# EasyEDA Pro project PCB.eprj

# Board PCB01
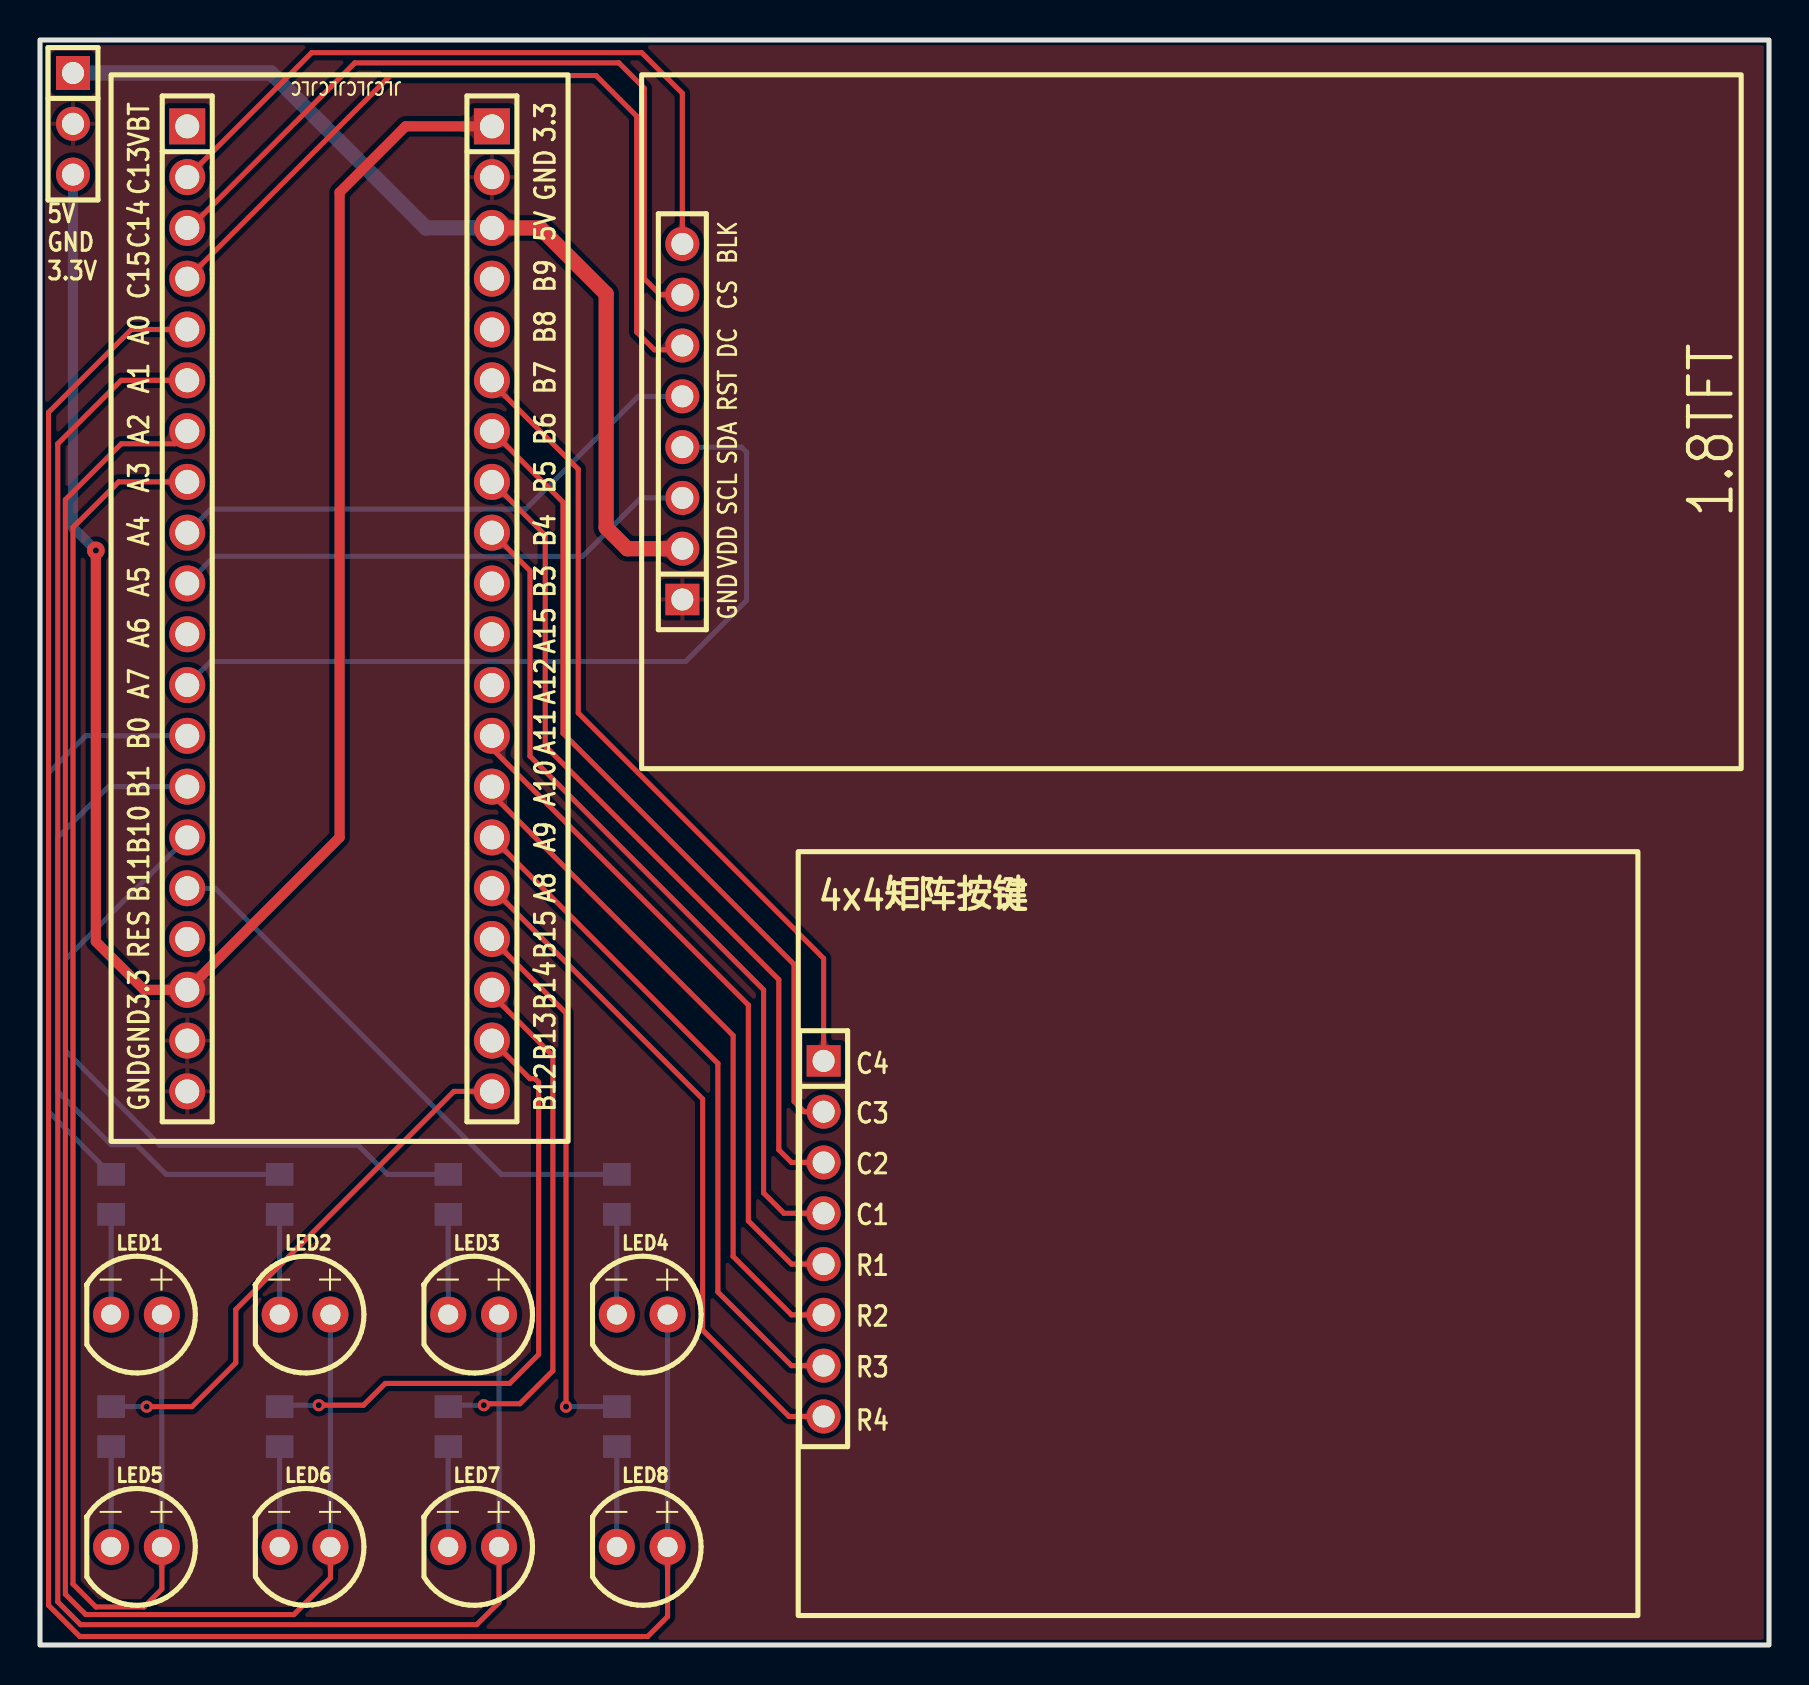
[diagram p0: board, top side]
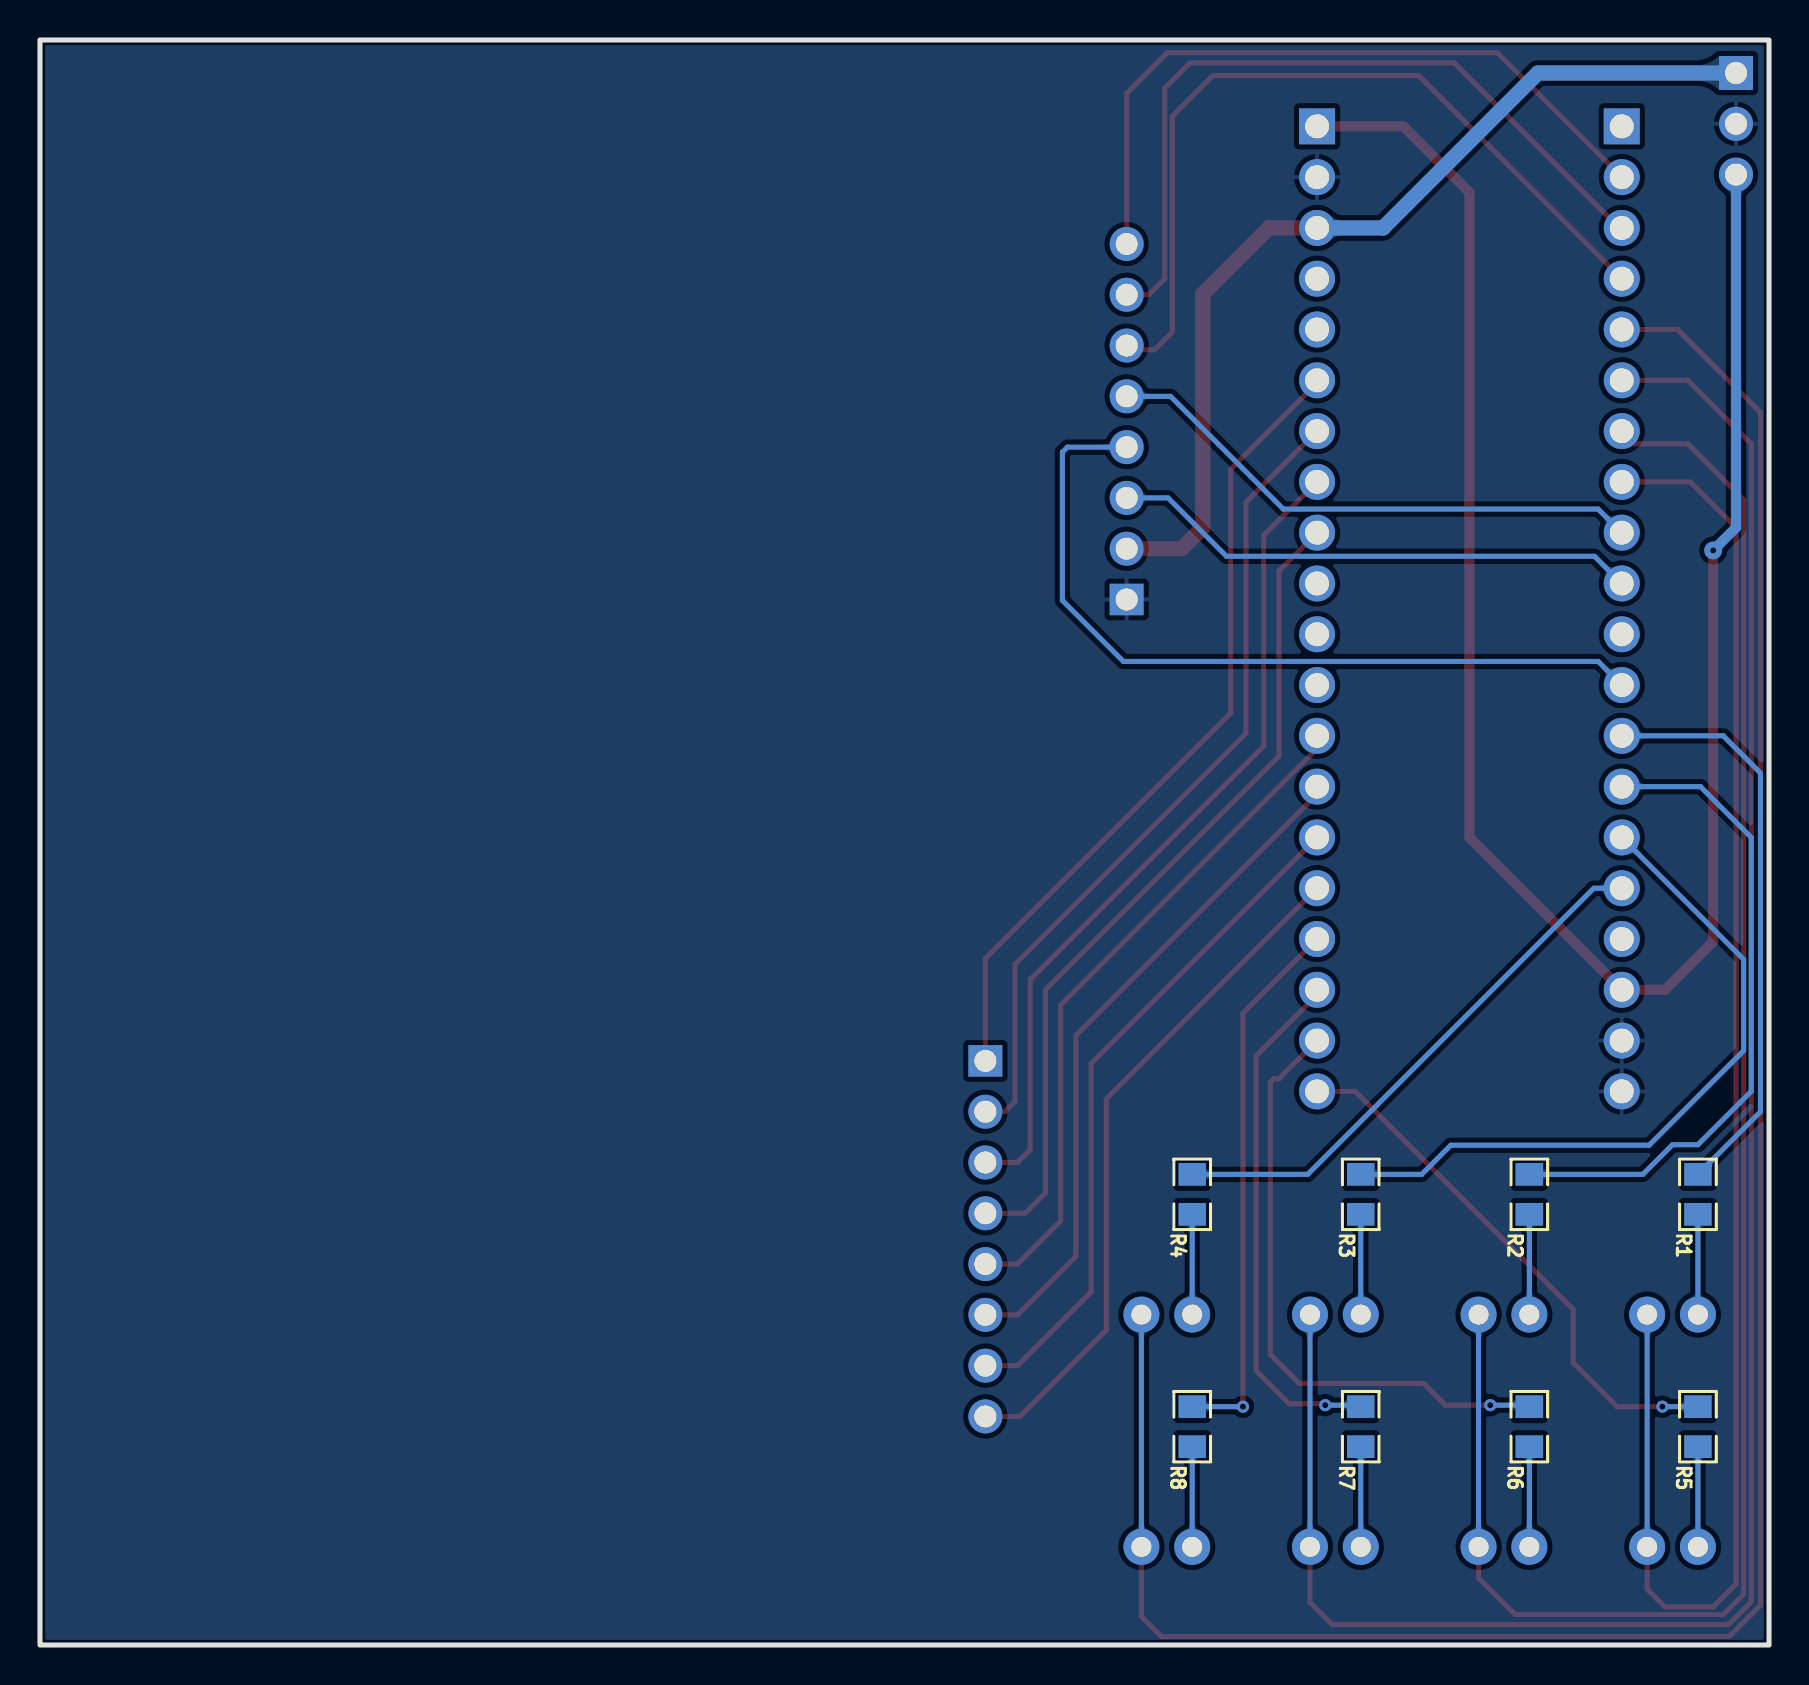
[diagram p1: board, bottom side, seen from below]

Outline 86.49 x 80.26 mm; copper layers: Top Layer, Bottom Layer. Coordinates in mm from the lower left corner of the outline.
Outline path: rectangle 0,80.26 86.49,0
Stack: Top Layer 0.035mm / Dielectric1 1.51mm FR4 er 4.5 / Bottom Layer 0.035mm

## Design rules (mm)
template: JLCPCB Capability(Two Layers Board)
spacing copperThickness1oz (default): track to track 0.102, other pairs 0.152 to 0.3
spacing copperThickness2oz: track to track 0.203, other pairs 0.152 to 0.3
track width copperThickness1oz (default): min 0.127, default 0.254, max 2.54
track width copperThickness2oz: min 0.203, default 0.254, max 2.54
differential pair differentialPair (default): width min 0.127, default 0.254, max 2.54; gap min 0.152, default 0.152
via viaSize (default): diameter min 0.5, default 0.61, max 10; hole min 0.3, default 0.305, max 6.3

## Placement (name value [footprint] x y rotation side)
H2  PZ254V-11-03P  [HDR-TH_3P-P2.54-V-M]  1.65 76.07 270 top
LED1  XL-502SURD  [LED-TH_BD5.9-P2.54-RD_RED]  4.83 16.52 0 top
LED2  XL-502SURD  [LED-TH_BD5.9-P2.54-RD_RED]  13.26 16.52 0 top
LED3  XL-502SURD  [LED-TH_BD5.9-P2.54-RD_RED]  21.69 16.52 0 top
LED4  XL-502SURD  [LED-TH_BD5.9-P2.54-RD_RED]  30.12 16.52 0 top
LED5  XL-502SURD  [LED-TH_BD5.9-P2.54-RD_RED]  4.83 4.91 0 top
LED6  XL-502SURD  [LED-TH_BD5.9-P2.54-RD_RED]  13.26 4.91 0 top
LED7  XL-502SURD  [LED-TH_BD5.9-P2.54-RD_RED]  21.69 4.91 0 top
LED8  XL-502SURD  [LED-TH_BD5.9-P2.54-RD_RED]  30.12 4.91 0 top
R1  100Ω  [R0805]  3.56 22.54 90 bottom
R2  100Ω  [R0805]  11.99 22.54 90 bottom
R3  100Ω  [R0805]  20.42 22.54 90 bottom
R4  100Ω  [R0805]  28.85 22.54 90 bottom
R5  100Ω  [R0805]  3.56 10.92 90 bottom
R6  100Ω  [R0805]  11.99 10.92 90 bottom
R7  100Ω  [R0805]  20.42 10.92 90 bottom
R8  100Ω  [R0805]  28.85 10.92 90 bottom
U1  -  [HDR-TH_20P-P2.54-V-F]  22.61 51.82 270 top
U1#2  -  [HDR-TH_8P-P2.54-V-F]  39.2 20.32 270 top
U1#3  -  [HDR-TH_8P-P2.54-V-F]  32.13 61.17 90 top
U2  BX-PM2.54-1-20PY  [HDR-TH_20P-P2.54-V-F]  7.37 51.82 270 top

## Footprints (pads in the part's own frame, mm; a bottom-side part is the same pattern mirrored in y, then rotated)
HDR-TH_3P-P2.54-V-M
  rect 1.7x1.7 hole 1.1: 1(-2.54,0)
  round 1.7 hole 1.1: 2(0,0) 3(2.54,0)
HDR-TH_8P-P2.54-V-F
  rect 1.575x1.7 hole 1.1: 1(-8.89,0)
  round 1.7 hole 1.1: 2(-6.35,0) 3(-3.81,0) 4(-1.27,0) 5(1.27,0) 6(3.81,0) 7(6.35,0) 8(8.89,0)
HDR-TH_20P-P2.54-V-F
  rect 1.8x1.8 hole 1.2: 1(-24.13,0)
  round 1.8 hole 1.2: 2(-21.59,0) 3(-19.05,0) 4(-16.51,0) 5(-13.97,0) 6(-11.43,0) 7(-8.89,0) 8(-6.35,0) 9(-3.81,0) 10(-1.27,0) 11(1.27,0) 12(3.81,0) 13(6.35,0) 14(8.89,0) 15(11.43,0) 16(13.97,0) 17(16.51,0) 18(19.05,0) 19(21.59,0) 20(24.13,0)
LED-TH_BD5.9-P2.54-RD_RED
  round 1.8 hole 1: 1(-1.27,0) 2(1.27,0)
R0805
  rect 1.133x1.377 smd: 1(-1,0) 2(1,0)

## Nets
3.3V: H2.3 U1.1 U2.18
5V: H2.1 U1.3 U1#3.2
GND: H2.2 U1.2 U1#3.1 U2.19 U2.20
A0: LED4.2 LED8.2 U2.5
A1: LED3.2 LED7.2 U2.6
A2: LED2.2 LED6.2 U2.7
A3: LED1.2 LED5.2 U2.8
A4: U1#3.5 U2.9
A5: U1#3.3 U2.10
A6: U2.11
A7: U1#3.4 U2.12
A8: U1.16 U1#2.8
A9: U1.15 U1#2.7
A10: U1.14 U1#2.6
A11: U1.13 U1#2.5
A12: U1.12
A15: U1.11
B0: R1.2 U2.13
B1: R2.2 U2.14
B3: U1.10
B4: U1.9 U1#2.4
B5: U1.8 U1#2.3
B6: U1.7 U1#2.2
B7: U1.6 U1#2.1
B8: U1.5
B9: U1.4
B10: R3.2 U2.15
B11: R4.2 U2.16
B12: R5.2 U1.20
B13: R6.2 U1.19
B14: R7.2 U1.18
B15: R8.2 U1.17
C13: U1#3.8 U2.2
C14: U1#3.7 U2.3
C15: U1#3.6 U2.4
L1: LED1.1 R1.1
L2: LED2.1 R2.1
L3: LED3.1 R3.1
L4: LED4.1 R4.1
L5: LED5.1 R5.1
L6: LED6.1 R6.1
L7: LED7.1 R7.1
L8: LED8.1 R8.1
RES: U2.17
VBT: U2.1

## Via types
v1: diameter 0.889, hole 0.305, Top Layer to Bottom Layer, 1 via
v2: diameter 0.61, hole 0.305, Top Layer to Bottom Layer, 4 vias

## Routing (per net, layer and track width the routed paths; a pad name or vN(x,y) marks a point on that pad's centre or on a via; arc(x,y) is an arc through that point)
3.3V: length 96.4
  Top Layer w0.508: v1(2.79,54.74) 2.79,35.18 5.21,32.77 U2.18 14.99,40.39 14.99,72.64 18.29,75.95 U1.1
  Bottom Layer w0.508: v1(2.79,54.74) 1.65,55.88 H2.3
5V: length 47.2
  Top Layer w0.762: U1#3.2 29.38,54.82 28.32,55.88 28.32,67.56 25.02,70.87 U1.3
  Bottom Layer w0.762: H2.1 11.56,78.61 19.3,70.87 U1.3
A0: length 115.4
  Top Layer w0.254: LED8.2 31.39,1.42 30.4,0.43 1.99,0.43 0.43,1.99 0.43,61.64 4.57,65.79 U2.5
  Bottom Layer w0.254: LED4.2 LED8.2
A1: length 103.1
  Top Layer w0.254: LED7.2 22.96,2.13 21.84,1.02 2.03,1.02 0.89,2.16 0.89,60.07 4.06,63.25 U2.6
  Bottom Layer w0.254: LED3.2 LED7.2
A2: length 89.9
  Top Layer w0.254: LED6.2 14.53,3.35 12.7,1.52 2.29,1.52 1.27,2.54 1.27,57.28 4.06,60.07 6.73,60.07 U2.7
  Bottom Layer w0.254: LED2.2 LED6.2
A3: length 78.5
  Top Layer w0.254: LED5.2 6.1,2.79 5.21,1.91 2.79,1.91 1.65,3.05 1.65,55.88 3.94,58.17 U2.8
  Bottom Layer w0.254: LED5.2 LED1.2
A4: length 27.6
  Bottom Layer w0.254: U2.9 8.55,56.81 24.29,56.81 29.93,62.44 U1#3.5
A5: length 26.5
  Bottom Layer w0.254: U1#3.3 30.06,57.36 27.14,54.45 8.73,54.45 U2.10
A7: length 40.5
  Bottom Layer w0.254: U1#3.4 35.09,59.9 35.35,59.65 35.35,52.24 32.29,49.19 8.55,49.19 U2.12
A8: length 34.3
  Top Layer w0.254: U1.16 33.15,27.31 33.15,15.75 37.47,11.43 U1#2.8
A9: length 34.2
  Top Layer w0.254: U1.15 33.91,29.08 33.91,17.65 37.59,13.97 U1#2.7
A10: length 34
  Top Layer w0.254: 22.23,42.93 34.67,30.48 34.67,19.43 37.59,16.51 38.82,16.51
A11: length 34.2
  Top Layer w0.254: U1#2.5 37.59,19.05 35.43,21.21 35.43,32 22.61,44.83 U1.13
B0: length 29.1
  Bottom Layer w0.254: R1.2 0.43,26.67 0.43,43.61 2.29,45.47 U2.13
B1: length 33
  Bottom Layer w0.254: R2.2 6.31,23.54 4.83,25.02 3.56,25.02 0.89,27.69 0.89,40.39 3.43,42.93 U2.14
B4: length 42.1
  Top Layer w0.254: U1#2.4 37.21,21.59 36.2,22.61 36.2,32.77 24.51,44.45 24.51,53.72 U1.9
B5: length 41.8
  Top Layer w0.254: U1.8 25.27,55.5 25.27,44.96 36.96,33.27 36.96,24.77 37.59,24.13 U1#2.3
B6: length 41.5
  Top Layer w0.254: U1#2.2 38.23,26.67 37.72,27.18 37.72,34.04 26.16,45.59 26.16,57.15 U1.7
B7: length 40.9
  Top Layer w0.254: U1.6 22.61,63.12 26.92,58.8 26.92,46.61 39.2,34.33 U1#2.1
B10: length 34.9
  Bottom Layer w0.254: R3.2 17.37,23.54 15.92,24.99 5.99,24.99 1.27,29.72 1.27,34.29 U2.15
B11: length 27.4
  Bottom Layer w0.254: R4.2 23.07,23.54 8.76,37.85 U2.16
B12: length 27.1
  Top Layer w0.254: U1.20 20.7,27.69 9.79,16.78 9.79,14.11 7.6,11.92 v2(5.33,11.92)
  Bottom Layer w0.254: R5.2 v2(5.33,11.92)
B13: length 30.9
  Top Layer w0.254: U1.19 24.51,28.32 24.77,28.32 24.94,28.14 24.94,14.53 23.5,13.08 17.27,13.08 16.19,11.99 v2(13.94,11.99)
  Bottom Layer w0.254: v2(13.94,11.99) 12.06,11.99 R6.2
B14: length 26.2
  Top Layer w0.254: 22.23,12.06 24,12.06 25.65,13.72 25.65,29.46 22.61,32.51 U1.18
  Bottom Layer w0.254: v2(22.2,11.99) 20.5,11.99 R7.2
B15: length 27.5
  Top Layer w0.254: U1.17 26.31,31.6 v2(26.31,11.92)
  Bottom Layer w0.254: v2(26.31,11.92) R8.2
C13: length 35.7
  Top Layer w0.254: U2.2 13.59,79.63 30.1,79.63 32.13,77.6 U1#3.8
C14: length 38.6
  Top Layer w0.254: U1#3.7 31.03,67.52 30.23,68.33 30.23,77.85 28.96,79.12 15.75,79.12 7.49,70.87 U2.3
C15: length 41.1
  Top Layer w0.254: U1#3.6 31.92,64.77 30.73,64.77 29.85,65.66 29.85,76.45 27.81,78.49 17.53,78.49 U2.4
L1: length 5
  Bottom Layer w0.254: R1.1 LED1.1
L2: length 5
  Bottom Layer w0.254: R2.1 LED2.1
L3: length 5
  Bottom Layer w0.254: R3.1 LED3.1
L4: length 5
  Bottom Layer w0.254: R4.1 LED4.1
L5: length 5
  Bottom Layer w0.254: R5.1 LED5.1
L6: length 5
  Bottom Layer w0.254: R6.1 LED6.1
L7: length 5
  Bottom Layer w0.254: R7.1 LED7.1
L8: length 5
  Bottom Layer w0.254: R8.1 LED8.1

## Copper pours and planes (outline as drawn; the poured copper is in the pictures)
GND on Top Layer: -14.6,91.82 118.36,91.82 118.36,-4.7 -14.6,-4.7
GND on Bottom Layer: -23.37,84.33 101.85,84.33 101.85,-8.25 -23.37,-8.25

Small or netless copper shapes (teardrops, artwork), in the pictures only: 44 on Top Layer, 50 on Bottom Layer

## Text on the board
Top Silkscreen Layer: JLCJLCJLCJLC | BLK | CS | DC | RST | SDA | SCL | VDD | GND | 5V / GND / 3.3V | C4 | C3 | C2 | C1 | R1 | R2 | R3 | R4 | VBT | C13 | C14 | C15 | A0 | A1 | A2 | A3 | A4 | A5 | A6 | A7 | B0 | B1 | B10 | B11 | RES | 3.3 | 5V | B9 | B8 | B7 | B6 | B5 | B4 | B3 | A15 | A12 | A11 | A10 | A9 | A8 | B15 | B14 | B13 | B12 | 1.8TFT | 4x4矩阵按键

# Board PCB02_ESP8266
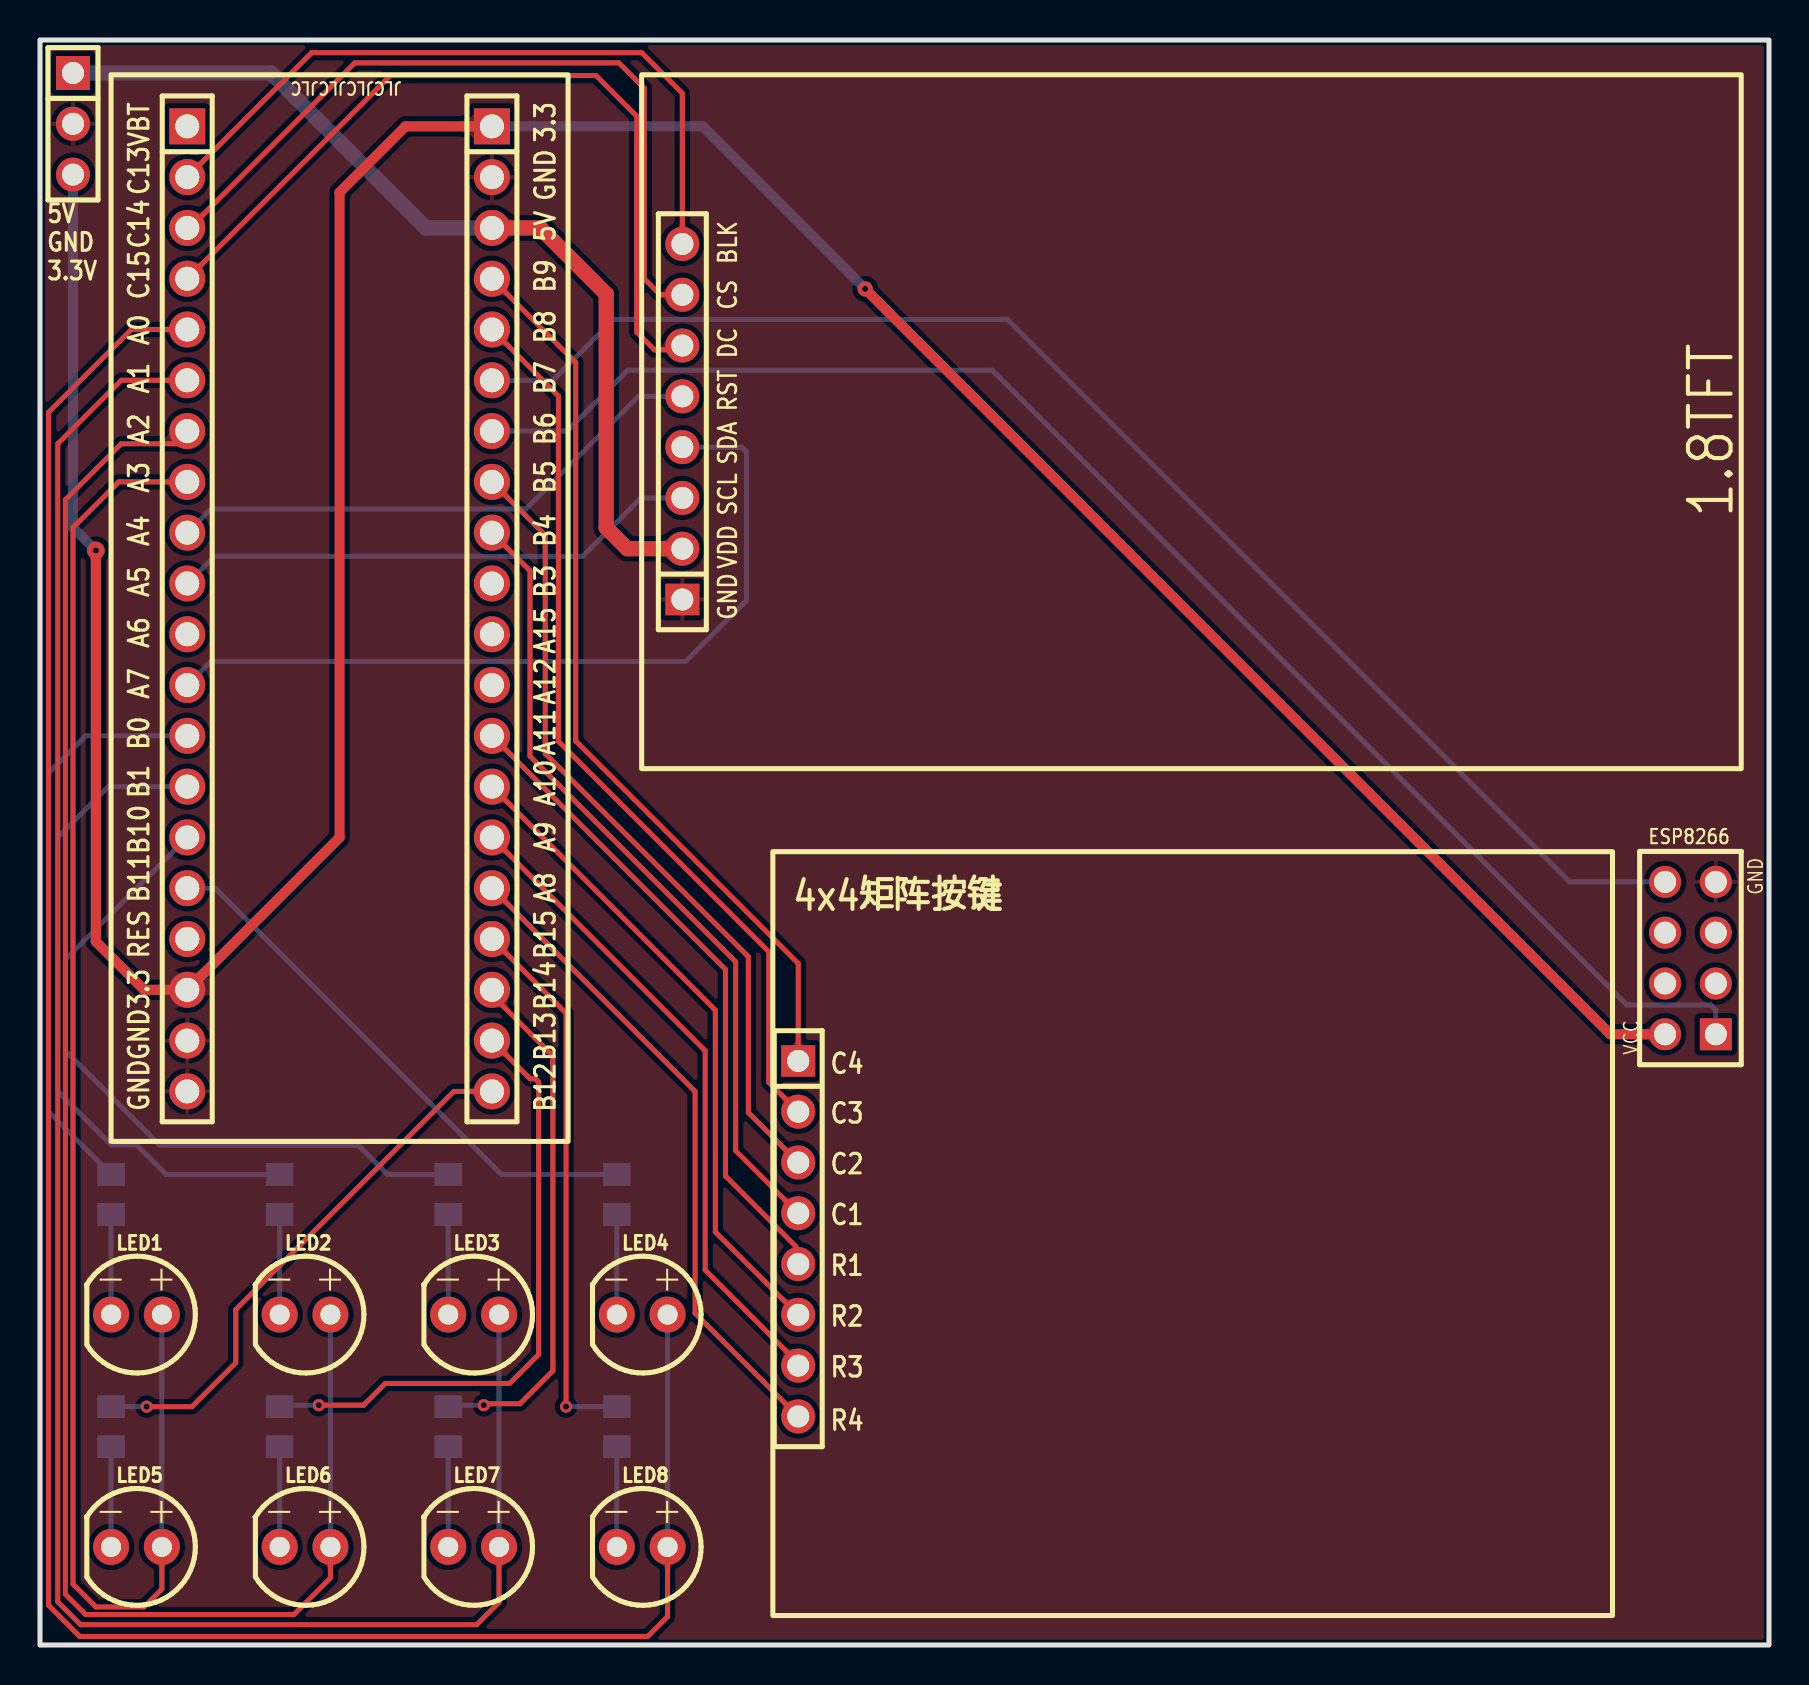
[diagram p2: board, top side]
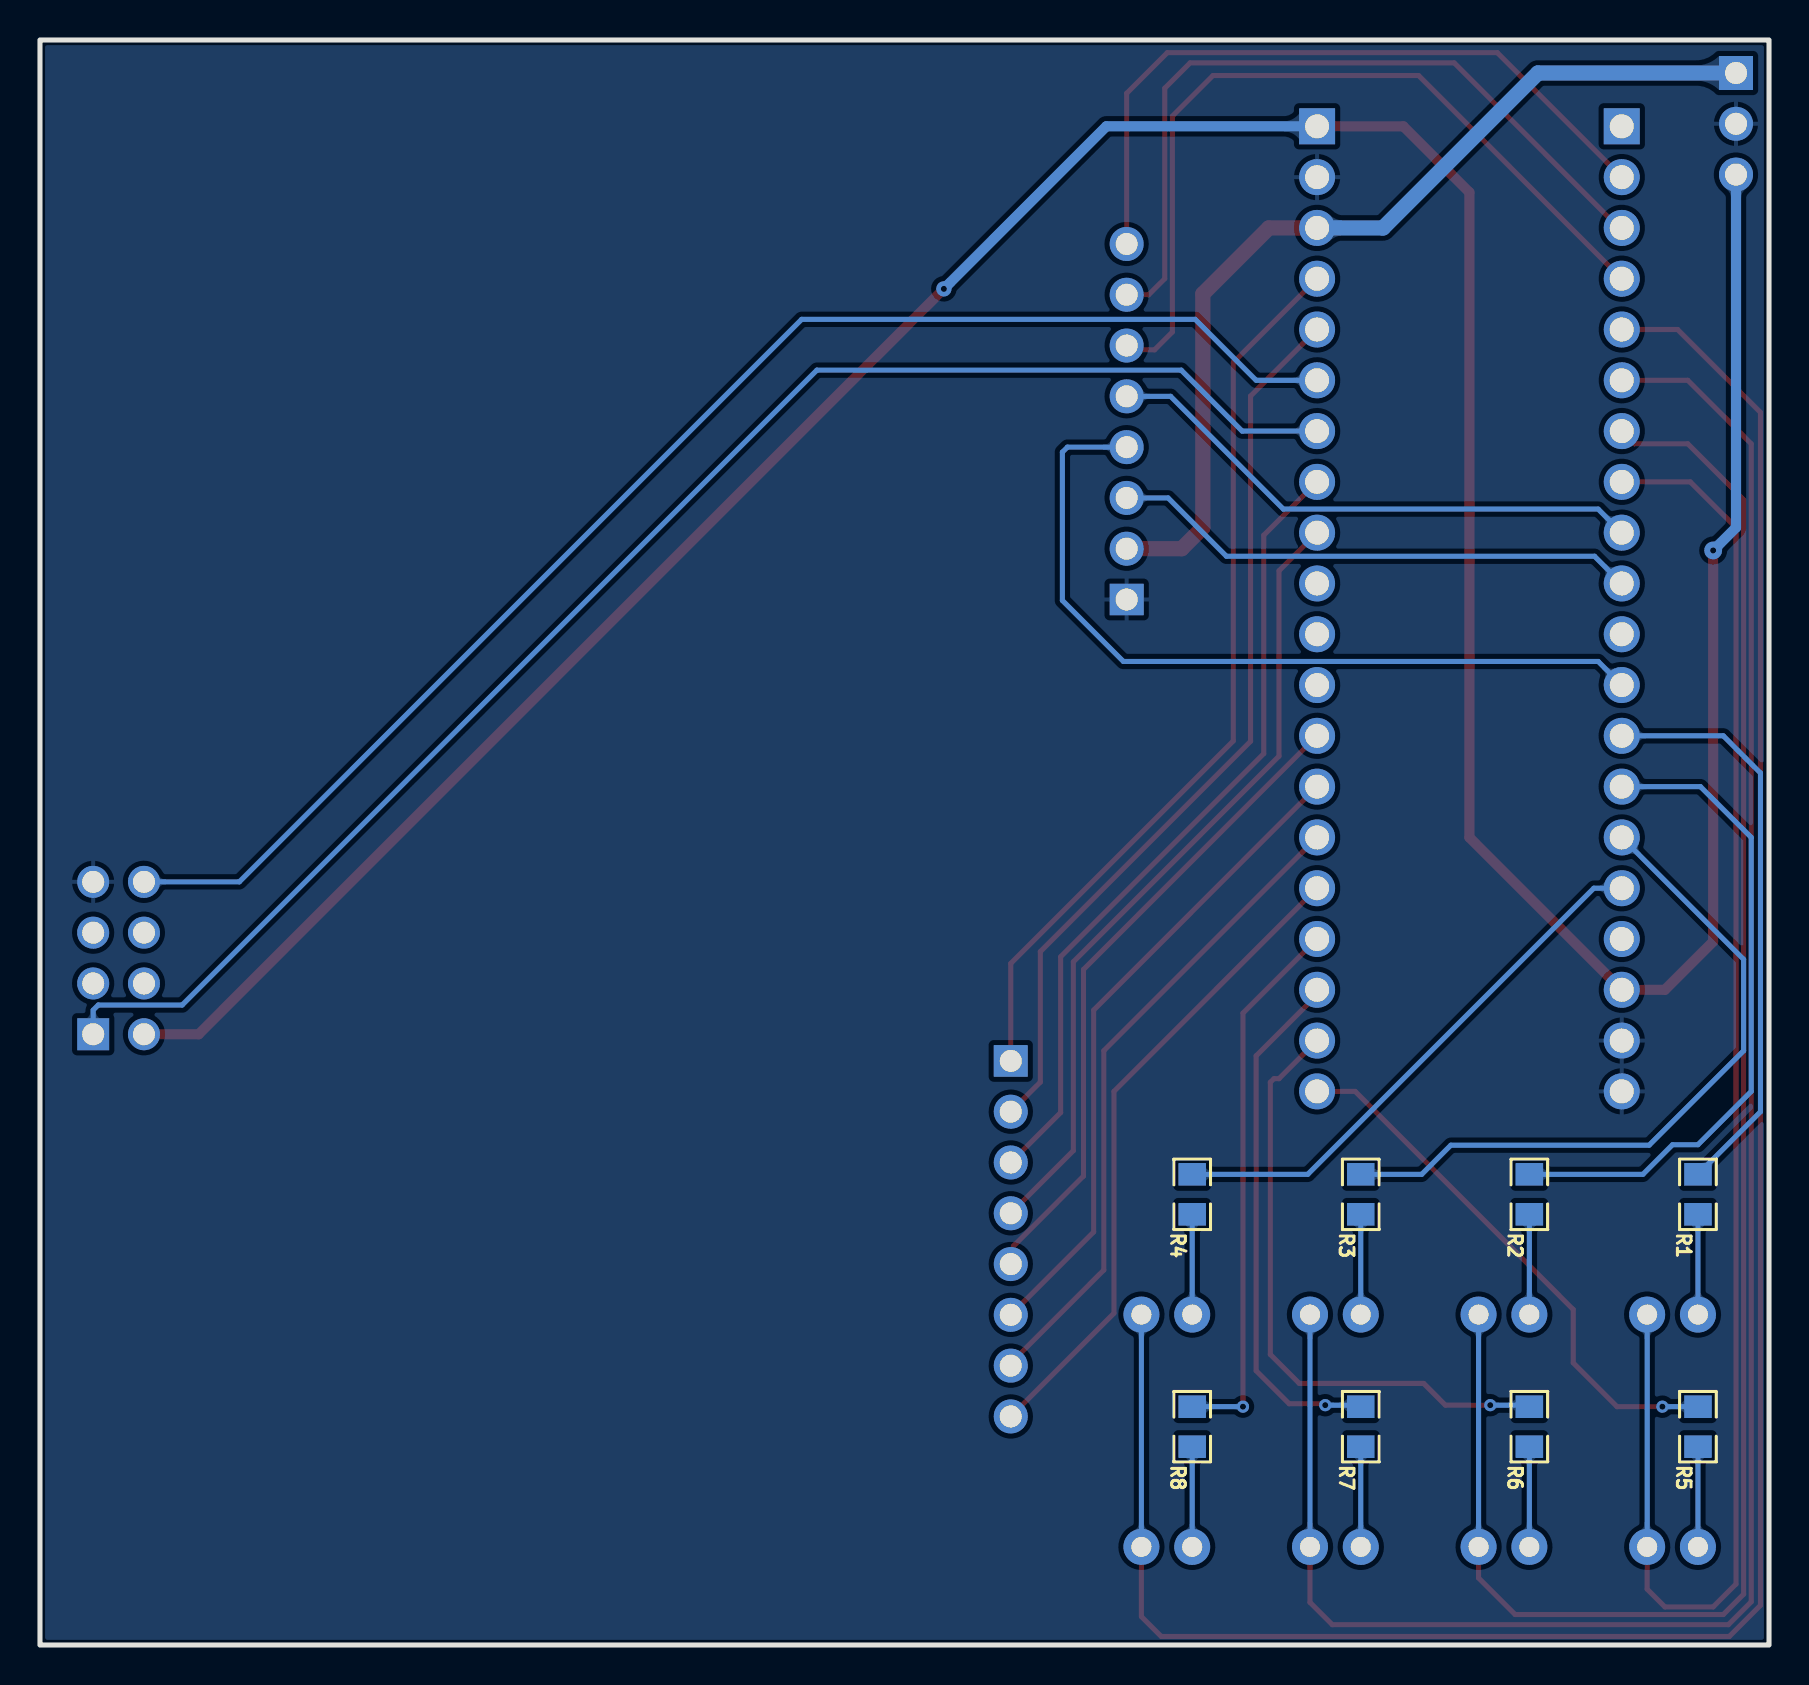
[diagram p3: board, bottom side, seen from below]

Outline 86.49 x 80.26 mm; copper layers: Top Layer, Bottom Layer. Coordinates in mm from the lower left corner of the outline.
Outline path: rectangle 0,80.26 86.49,0
Stack: Top Layer 0.035mm / Dielectric1 1.51mm FR4 er 4.5 / Bottom Layer 0.035mm

## Design rules (mm)
template: JLCPCB Capability(Two Layers Board)
spacing copperThickness1oz (default): track to track 0.102, other pairs 0.152 to 0.3
spacing copperThickness2oz: track to track 0.203, other pairs 0.152 to 0.3
track width copperThickness1oz (default): min 0.127, default 0.254, max 2.54
track width copperThickness2oz: min 0.203, default 0.254, max 2.54
differential pair differentialPair (default): width min 0.127, default 0.254, max 2.54; gap min 0.152, default 0.152
via viaSize (default): diameter min 0.5, default 0.61, max 10; hole min 0.3, default 0.305, max 6.3

## Placement (name value [footprint] x y rotation side)
H1  PM254V-12-08-H85  [HDR-TH_8P-P2.54-V-F-R2-C4-S2.54]  82.56 34.35 90 top
H2  PZ254V-11-03P  [HDR-TH_3P-P2.54-V-M]  1.65 76.07 270 top
LED1  XL-502SURD  [LED-TH_BD5.9-P2.54-RD_RED]  4.83 16.52 0 top
LED2  XL-502SURD  [LED-TH_BD5.9-P2.54-RD_RED]  13.26 16.52 0 top
LED3  XL-502SURD  [LED-TH_BD5.9-P2.54-RD_RED]  21.69 16.52 0 top
LED4  XL-502SURD  [LED-TH_BD5.9-P2.54-RD_RED]  30.12 16.52 0 top
LED5  XL-502SURD  [LED-TH_BD5.9-P2.54-RD_RED]  4.83 4.91 0 top
LED6  XL-502SURD  [LED-TH_BD5.9-P2.54-RD_RED]  13.26 4.91 0 top
LED7  XL-502SURD  [LED-TH_BD5.9-P2.54-RD_RED]  21.69 4.91 0 top
LED8  XL-502SURD  [LED-TH_BD5.9-P2.54-RD_RED]  30.12 4.91 0 top
R1  100Ω  [R0805]  3.56 22.54 90 bottom
R2  100Ω  [R0805]  11.99 22.54 90 bottom
R3  100Ω  [R0805]  20.42 22.54 90 bottom
R4  100Ω  [R0805]  28.85 22.54 90 bottom
R5  100Ω  [R0805]  3.56 10.92 90 bottom
R6  100Ω  [R0805]  11.99 10.92 90 bottom
R7  100Ω  [R0805]  20.42 10.92 90 bottom
R8  100Ω  [R0805]  28.85 10.92 90 bottom
U1  -  [HDR-TH_20P-P2.54-V-F]  22.61 51.82 270 top
U1#2  -  [HDR-TH_8P-P2.54-V-F]  32.13 61.17 90 top
U1#3  -  [HDR-TH_8P-P2.54-V-F]  37.93 20.32 270 top
U2  BX-PM2.54-1-20PY  [HDR-TH_20P-P2.54-V-F]  7.37 51.82 270 top

## Footprints (pads in the part's own frame, mm; a bottom-side part is the same pattern mirrored in y, then rotated)
HDR-TH_3P-P2.54-V-M
  rect 1.7x1.7 hole 1.1: 1(-2.54,0)
  round 1.7 hole 1.1: 2(0,0) 3(2.54,0)
HDR-TH_8P-P2.54-V-F
  rect 1.575x1.7 hole 1.1: 1(-8.89,0)
  round 1.7 hole 1.1: 2(-6.35,0) 3(-3.81,0) 4(-1.27,0) 5(1.27,0) 6(3.81,0) 7(6.35,0) 8(8.89,0)
HDR-TH_8P-P2.54-V-F-R2-C4-S2.54
  rect 1.6x1.6 hole 1.1: 1(-3.81,-1.27)
  round 1.6 hole 1.1: 2(-3.81,1.27) 3(-1.27,-1.27) 4(-1.27,1.27) 5(1.27,-1.27) 6(1.27,1.27) 7(3.81,-1.27) 8(3.81,1.27)
HDR-TH_20P-P2.54-V-F
  rect 1.8x1.8 hole 1.2: 1(-24.13,0)
  round 1.8 hole 1.2: 2(-21.59,0) 3(-19.05,0) 4(-16.51,0) 5(-13.97,0) 6(-11.43,0) 7(-8.89,0) 8(-6.35,0) 9(-3.81,0) 10(-1.27,0) 11(1.27,0) 12(3.81,0) 13(6.35,0) 14(8.89,0) 15(11.43,0) 16(13.97,0) 17(16.51,0) 18(19.05,0) 19(21.59,0) 20(24.13,0)
LED-TH_BD5.9-P2.54-RD_RED
  round 1.8 hole 1: 1(-1.27,0) 2(1.27,0)
R0805
  rect 1.133x1.377 smd: 1(-1,0) 2(1,0)

## Nets
3.3V: H1.2 H2.3 U1.1 U2.18
5V: H2.1 U1.3 U1#2.2
GND: H1.7 H2.2 U1.2 U1#2.1 U2.19 U2.20
A0: LED4.2 LED8.2 U2.5
A1: LED3.2 LED7.2 U2.6
A2: LED2.2 LED6.2 U2.7
A3: LED1.2 LED5.2 U2.8
A4: U1#2.5 U2.9
A5: U1#2.3 U2.10
A6: U2.11
A7: U1#2.4 U2.12
A8: U1.16 U1#3.8
A9: U1.15 U1#3.7
A10: U1.14 U1#3.6
A11: U1.13 U1#3.5
A12: U1.12
A15: U1.11
B0: R1.2 U2.13
B1: R2.2 U2.14
B3: U1.10
B4: U1.9 U1#3.4
B5: U1.8 U1#3.3
B6: H1.1 U1.7
B7: H1.8 U1.6
B8: U1.5 U1#3.2
B9: U1.4 U1#3.1
B10: R3.2 U2.15
B11: R4.2 U2.16
B12: R5.2 U1.20
B13: R6.2 U1.19
B14: R7.2 U1.18
B15: R8.2 U1.17
C13: U1#2.8 U2.2
C14: U1#2.7 U2.3
C15: U1#2.6 U2.4
L1: LED1.1 R1.1
L2: LED2.1 R2.1
L3: LED3.1 R3.1
L4: LED4.1 R4.1
L5: LED5.1 R5.1
L6: LED6.1 R6.1
L7: LED7.1 R7.1
L8: LED8.1 R8.1
RES: U2.17
VBT: U2.1

Pads without a net: H1 3 4 5 6

## Via types
v1: diameter 0.889, hole 0.305, Top Layer to Bottom Layer, 1 via
v2: diameter 0.762, hole 0.305, Top Layer to Bottom Layer, 1 via
v3: diameter 0.61, hole 0.305, Top Layer to Bottom Layer, 4 vias

## Routing (per net, layer and track width the routed paths; a pad name or vN(x,y) marks a point on that pad's centre or on a via; arc(x,y) is an arc through that point)
3.3V: length 173.9
  Top Layer w0.508: v2(41.27,67.82) 78.55,30.54 81.29,30.54 ; U1.1 18.29,75.95 14.99,72.64 14.99,40.39 U2.18 5.21,32.77 2.79,35.18 v1(2.79,54.74)
  Bottom Layer w0.508: v2(41.27,67.82) 33.15,75.95 U1.1 ; H2.3 1.65,55.88 v1(2.79,54.74)
5V: length 47.2
  Top Layer w0.762: U1#2.2 29.38,54.82 28.32,55.88 28.32,67.56 25.02,70.87 U1.3
  Bottom Layer w0.762: H2.1 11.56,78.61 19.3,70.87 U1.3
A0: length 115.4
  Top Layer w0.254: LED8.2 31.39,1.42 30.4,0.43 1.99,0.43 0.43,1.99 0.43,61.64 4.57,65.79 U2.5
  Bottom Layer w0.254: LED4.2 LED8.2
A1: length 103.1
  Top Layer w0.254: U2.6 4.06,63.25 0.89,60.07 0.89,2.16 2.03,1.02 21.84,1.02 22.96,2.13 22.96,4.91
  Bottom Layer w0.254: 22.96,16.52 22.96,4.91
A2: length 89.9
  Top Layer w0.254: U2.7 6.73,60.07 4.06,60.07 1.27,57.28 1.27,2.54 2.29,1.52 12.7,1.52 14.53,3.35 LED6.2
  Bottom Layer w0.254: LED2.2 LED6.2
A3: length 78.5
  Top Layer w0.254: LED5.2 6.1,2.79 5.21,1.91 2.79,1.91 1.65,3.05 1.65,55.88 3.94,58.17 U2.8
  Bottom Layer w0.254: LED5.2 LED1.2
A4: length 27.6
  Bottom Layer w0.254: U2.9 8.55,56.81 24.29,56.81 29.93,62.44 U1#2.5
A5: length 26.5
  Bottom Layer w0.254: U2.10 8.73,54.45 27.14,54.45 30.06,57.36 U1#2.3
A7: length 40.5
  Bottom Layer w0.254: U2.12 8.55,49.19 32.29,49.19 35.35,52.24 35.35,59.65 35.09,59.9 U1#2.4
A8: length 32.8
  Top Layer w0.254: U1#3.8 32.77,16.59 32.77,27.69 U1.16
A9: length 32.8
  Top Layer w0.254: U1.15 33.27,29.72 33.27,18.75 38.05,13.97
A10: length 33.1
  Top Layer w0.254: U1#3.6 33.78,20.66 33.78,31.75 U1.14 22.22,42.93
A11: length 32.8
  Top Layer w0.254: U1.13 34.29,33.78 34.29,23.45 37.8,19.94 37.8,19.3 38.05,19.05
B0: length 29.1
  Bottom Layer w0.254: U2.13 2.29,45.47 0.43,43.61 0.43,26.67 R1.2
B1: length 33
  Bottom Layer w0.254: U2.14 3.43,42.93 0.89,40.39 0.89,27.69 3.56,25.02 4.83,25.02 6.31,23.54 R2.2
B4: length 40.4
  Top Layer w0.254: U1#3.4 34.8,24.72 34.8,34.16 24.51,44.45 24.51,53.72 U1.9
B5: length 40.4
  Top Layer w0.254: U1#3.3 35.43,26.62 35.43,34.42 25.27,44.58 25.27,55.5 U1.8
B6: length 76.9
  Bottom Layer w0.254: U1.7 26.35,60.71 29.4,63.75 47.62,63.75 79.37,32 83.57,32 83.83,31.75 83.83,30.54
B7: length 71.6
  Bottom Layer w0.254: H1.8 76.52,38.16 48.39,66.29 28.7,66.29 25.65,63.25 U1.6
B8: length 45.5
  Top Layer w0.254: U1.5 25.93,62.46 25.93,45.19 36.45,34.68 36.45,28.15 U1#3.2
B9: length 45.5
  Top Layer w0.254: U1.4 26.8,64.14 26.8,45.21 37.93,34.08 U1#3.1
B10: length 34.9
  Bottom Layer w0.254: U2.15 1.27,34.29 1.27,29.72 5.99,24.99 15.91,24.99 17.37,23.54 R3.2
B11: length 27.4
  Bottom Layer w0.254: U2.16 8.76,37.85 23.07,23.54 R4.2
B12: length 27.1
  Top Layer w0.254: U1.20 20.7,27.69 9.79,16.78 9.79,14.11 7.6,11.92 v3(5.33,11.92)
  Bottom Layer w0.254: R5.2 v3(5.33,11.92)
B13: length 30.9
  Top Layer w0.254: v3(13.94,11.99) 16.18,11.99 17.27,13.08 23.49,13.08 24.94,14.53 24.94,28.14 24.77,28.32 24.51,28.32 U1.19
  Bottom Layer w0.254: v3(13.94,11.99) 12.06,11.99 R6.2
B14: length 26.2
  Top Layer w0.254: 22.22,12.06 24,12.06 25.65,13.72 25.65,29.46 22.61,32.51 U1.18
  Bottom Layer w0.254: v3(22.2,11.99) 20.5,11.99 R7.2
B15: length 27.5
  Top Layer w0.254: U1.17 26.31,31.6 v3(26.31,11.92)
  Bottom Layer w0.254: v3(26.31,11.92) R8.2
C13: length 35.7
  Top Layer w0.254: U1#2.8 32.13,77.6 30.1,79.63 13.59,79.63 U2.2
C14: length 38.6
  Top Layer w0.254: U2.3 7.49,70.87 15.75,79.12 28.96,79.12 30.23,77.85 30.23,68.33 31.03,67.52 U1#2.7
C15: length 41.1
  Top Layer w0.254: U2.4 17.53,78.49 27.81,78.49 29.84,76.45 29.84,65.66 30.73,64.77 31.92,64.77 U1#2.6
L1: length 5
  Bottom Layer w0.254: R1.1 LED1.1
L2: length 5
  Bottom Layer w0.254: R2.1 LED2.1
L3: length 5
  Bottom Layer w0.254: R3.1 LED3.1
L4: length 5
  Bottom Layer w0.254: R4.1 LED4.1
L5: length 5
  Bottom Layer w0.254: R5.1 LED5.1
L6: length 5
  Bottom Layer w0.254: R6.1 LED6.1
L7: length 5
  Bottom Layer w0.254: R7.1 LED7.1
L8: length 5
  Bottom Layer w0.254: R8.1 LED8.1

## Copper pours and planes (outline as drawn; the poured copper is in the pictures)
GND on Top Layer: -27.18,83.44 102.36,83.44 102.36,-32.51 -27.18,-32.51
GND on Bottom Layer: -9.4,92.71 136.65,92.71 136.65,-3.94 -9.4,-3.94

Small or netless copper shapes (teardrops, artwork), in the pictures only: 46 on Top Layer, 56 on Bottom Layer

## Text on the board
Top Silkscreen Layer: JLCJLCJLCJLC | VCC | GND | ESP8266 | BLK | CS | DC | RST | SDA | SCL | VDD | 5V / GND / 3.3V | C4 | C3 | C2 | C1 | R1 | R2 | R3 | R4 | VBT | C13 | C14 | C15 | A0 | A1 | A2 | A3 | A4 | A5 | A6 | A7 | B0 | B1 | B10 | B11 | RES | 3.3 | 5V | B9 | B8 | B7 | B6 | B5 | B4 | B3 | A15 | A12 | A11 | A10 | A9 | A8 | B15 | B14 | B13 | B12 | 1.8TFT | 4x4矩阵按键
